# Altium schematic sheet Teensy Troller.SchDoc: Microcontroller with Sensors for Servos
size Letter; Author: Prof. Jeremy Daily; Organization: The University of Tulsa; Address1: Mechanical Engineering; Address2: 800 S. Tucker Dr; Address3: Tulsa, OK 74104; DocumentNumber: 1; Revision: 1; SheetNumber: 1; SheetTotal: 1
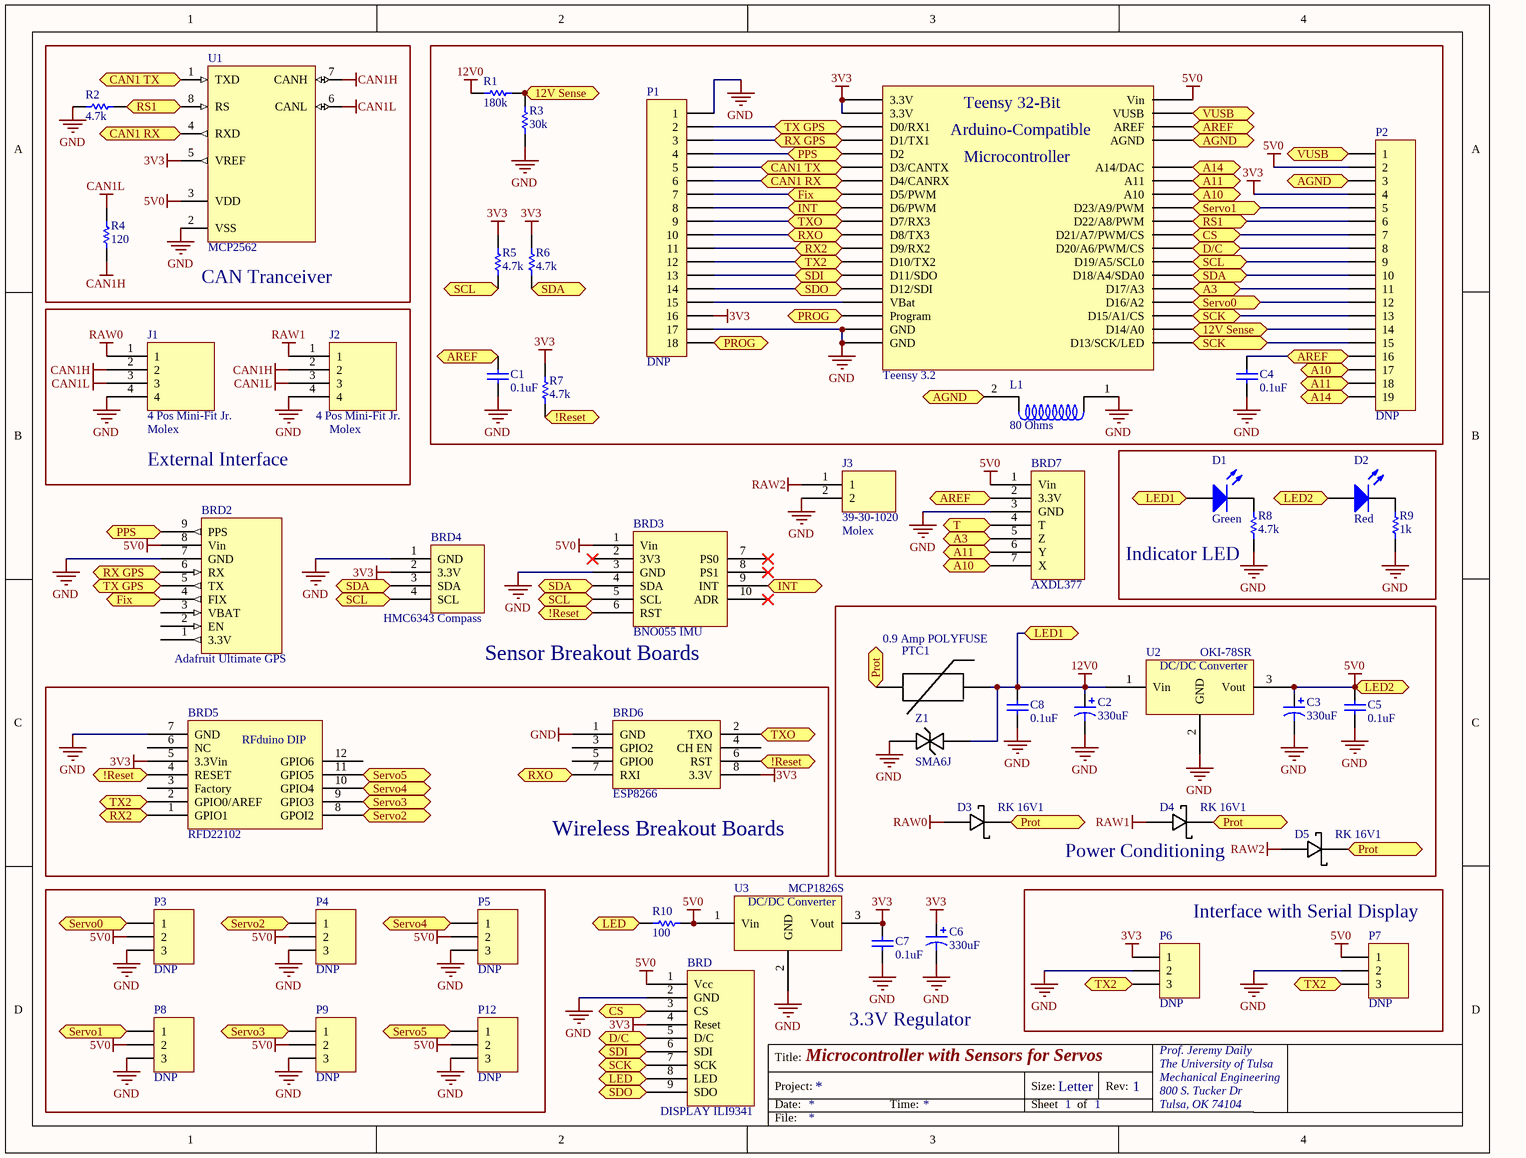
[diagram p0: Teensy Troller.SchDoc]

## Parts
BRD  DISPLAY ILI9341  [Display ILI9341]
BRD1  Teensy 3.2  [Teensy]
BRD2  Adafruit Ultimate GPS  [GPS]
BRD3  BNO055 IMU  [BNO055 Board]
BRD4  HMC6343 Compass  [HMC6343]
BRD5  RFD22102  [Simblee RFduino Adapter]
BRD6  ESP8266  [ESP8266]
BRD7  AXDL377  [AXDL377 Breakout]
C1  0.1uF  [RAD-0.2]
C2  330uF  [Elec. Cap 5 x 10mm]
C3  330uF  [Elec. Cap 5 x 10mm]
C4  0.1uF  [RAD-0.2]
C5  0.1uF  [RAD-0.2]
C6  330uF  [Elec. Cap 5 x 10mm]
C7  0.1uF  [RAD-0.2]
C8  0.1uF  [RAD-0.2]
D1  Green  [5mm Rad LED]
D2  Red  [5mm Rad LED]
D3  RK 16V1  [DIODE-0.4]
D4  RK 16V1  [DIODE-0.4]
D5  RK 16V1  [DIODE-0.4]
J1  4 Pos Mini-Fit Jr.  Manufacturer: Molex  [4 POS Vertical MINI-FIT JR]
J2  4 Pos Mini-Fit Jr.  Manufacturer: Molex  [4 POS Vertical MINI-FIT JR]
J3  39-30-1020  Manufacturer: Molex  [2 pos Mini-Fit Jr. R/A Header]
L1  80 Ohms  [0805]
P1  DNP  [HDR1X18]
P2  DNP  [HDR1X19]
P3  DNP  [HDR1X3]
P4  DNP  [HDR1X3]
P5  DNP  [HDR1X3]
P6  DNP  [HDR1X3]
P7  DNP  [HDR1X3]
P8  DNP  [HDR1X3]
P9  DNP  [HDR1X3]
P12  DNP  [HDR1X3]
PTC1  0.9 Amp POLYFUSE  [PTC]
R1  180k  [Axial-0.4]
R2  4.7k  [Axial-0.4]
R3  30k  [Axial-0.4]
R4  120  [Axial-0.4]
R5  4.7k  [Axial-0.4]
R6  4.7k  [Axial-0.4]
R7  4.7k  [Axial-0.4]
R8  4.7k  [Axial-0.4]
R9  1k  [Axial-0.4]
R10  100  [Axial-0.4]
U1  MCP2562  [PDIP300-P8]
U2  OKI-78SR  [78xx]
U3  MCP1826S  [78xx]
Z1  SMA6J  [DIODE-0.4]

## Blocks framed on the sheet
CAN Tranceiver: R2 R4 U1
External Interface: J1 J2
Indicator LED: D1 D2 R8 R9
Power Conditioning: C2 C3 C5 C8 D3-D5 PTC1 U2 Z1
Wireless Breakout Boards: BRD5 BRD6
Interface with Serial Display: P6 P7

## Ports
12V Sense, !Reset, A3, A10, A11, A14, AGND, AREF, CAN1 RX, CAN1 TX, CS, D/C, Fix, INT, LED, LED1, LED2, PPS, PROG, Prot, RS1, RX2, RX GPS, RXO, SCK, SCL, SDA, SDI, SDO, Servo0, Servo1, Servo2, Servo3, Servo4, Servo5, T, TX2, TX GPS, TXO, VUSB

## Nets
3V3: BRD.4(Reset) BRD1.16(3.3V) BRD1.31(3.3V) BRD4.2(3.3V) BRD5.5(3.3Vin) BRD6.8(3.3V) C6.1 C7.2 P1.16 P2.4 P6.1 R5.2 R6.2 R7.2 U1.5(VREF) U3.3(Vout)
5V0: BRD.1(Vcc) BRD1.33(Vin) BRD2.8(Vin) BRD3.1(Vin) BRD7.1(Vin) C3.1 C5.2 D2.1(A) P2.2 P3.2 P4.2 P5.2 P7.1 P8.2 P9.2 P12.2 R10.2 U1.3(VDD) U2.3(Vout) U3.1(Vin) ; port LED2
12V0: C2.1 C8.2 D1.1(A) PTC1.2 R1.1 U2.1(Vin) Z1.1(A) ; port LED1
CAN1H: J1.2 J2.2 R4.1 U1.7(CANH)
CAN1L: J1.3 J2.3 R4.2 U1.6(CANL)
GND: BRD.2(GND) BRD1.14(GND) BRD1.17(GND) BRD2.7(GND) BRD3.3(GND) BRD4.1(GND) BRD5.7(GND) BRD6.1(GND) BRD7.3(GND) C1.1 C2.2 C3.2 C4.1 C5.1 C6.2 C7.1 C8.1 J1.4 J2.4 J3.2 L1.1 P1.1 P1.17 P3.3 P4.3 P5.3 P6.2 P7.2 P8.3 P9.3 P12.3 R2.1 R3.1 R8.1 R9.1 U1.2(VSS) U2.2(GND) U3.2(GND) Z1.2(K)
RAW0: D3.1(A) J1.1
RAW1: D4.1(A) J2.1
RAW2: D5.1(A) J3.1
12V Sense: BRD1.21(D14/A0) P2.14 R1.2 R3.2 ; port 12V Sense
!Reset: BRD3.6(RST) BRD5.4(RESET) BRD6.6(RST) R7.1 ; port !Reset
A3: BRD1.24(D17/A3) BRD7.5(Z) P2.11 ; port A3
A10: BRD1.36(A10) BRD7.7(X) P2.17 ; port A10
A11: BRD1.37(A11) BRD7.6(Y) P2.18 ; port A11
A14: BRD1.19(A14/DAC) P2.19 ; port A14
AGND: BRD1.32(AGND) L1.2 P2.3 ; port AGND
AREF: BRD1.35(AREF) BRD7.2(3.3V) C1.2 C4.2 P2.16 ; port AREF
CAN1 RX: BRD1.9(D4/CANRX) P1.6 U1.4(RXD) ; port CAN1 RX
CAN1 TX: BRD1.10(D3/CANTX) P1.5 U1.1(TXD) ; port CAN1 TX
CS: BRD.3(CS) BRD1.28(D21/A7/PWM/CS) P2.7 ; port CS
D/C: BRD.5(D/C) BRD1.27(D20/A6/PWM/CS) P2.8 ; port D/C
Fix: BRD1.8(D5/PWM) BRD2.4(FIX) P1.7 ; port Fix
INT: BRD1.7(D6/PWM) BRD3.9(INT) P1.8 ; port INT
LED: BRD.8(LED) R10.1 ; port LED
PPS: BRD1.11(D2) BRD2.9(PPS) P1.4 ; port PPS
PROG: BRD1.18(Program) P1.18 ; port PROG
Prot: D3.2(K) D4.2(K) D5.2(K) PTC1.1 ; port Prot
RS1: BRD1.29(D22/A8/PWM) P2.6 R2.2 U1.8(RS) ; port RS1
RX2: BRD1.4(D9/RX2) BRD5.1(GPIO1) P1.11 ; port RX2
RX GPS: BRD1.12(D1/TX1) BRD2.6(RX) P1.3 ; port RX GPS
RXO: BRD1.5(D8/TX3) BRD6.7(RXI) P1.10 ; port RXO
SCK: BRD.7(SCK) BRD1.20(D13/SCK/LED) BRD1.22(D15/A1/CS) P2.13 P2.15 ; port SCK
SCL: BRD1.26(D19/A5/SCL0) BRD3.5(SCL) BRD4.4(SCL) P2.9 R5.1 ; port SCL
SDA: BRD1.25(D18/A4/SDA0) BRD3.4(SDA) BRD4.3(SDA) P2.10 R6.1 ; port SDA
SDI: BRD.6(SDI) BRD1.2(D11/SDO) P1.13 ; port SDI
SDO: BRD.9(SDO) BRD1.1(D12/SDI) P1.14 ; port SDO
Servo0: BRD1.23(D16/A2) P2.12 P3.1 ; port Servo0
Servo1: BRD1.30(D23/A9/PWM) P2.5 P8.1 ; port Servo1
Servo2: BRD5.8(GPOI2) P4.1 ; port Servo2
Servo3: BRD5.9(GPIO3) P9.1 ; port Servo3
Servo4: BRD5.10(GPIO4) P5.1 ; port Servo4
Servo5: BRD5.11(GPIO5) P12.1 ; port Servo5
T: BRD7.4(T) ; port T
TX2: BRD1.3(D10/TX2) BRD5.2(GPIO0/AREF) P1.12 P6.3 P7.3 ; port TX2
TX GPS: BRD1.13(D0/RX1) BRD2.5(TX) P1.2 ; port TX GPS
TXO: BRD1.6(D7/RX3) BRD6.2(TXO) P1.9 ; port TXO
VUSB: BRD1.34(VUSB) P2.1 ; port VUSB
NetBRD1_15: BRD1.15(VBat) P1.15
NetD1_2: D1.2(K) R8.2
NetD2_2: D2.2(K) R9.2

Not connected (* = marked no-connect by the designer): BRD2 1(3.3V) 2(EN) 3(VBAT); BRD3 2(3V3)* 7(PS0)* 8(PS1)* 10(ADR)*; BRD5 3(Factory) 6(NC) 12(GPIO6); BRD6 3(GPIO2) 4(CH_EN) 5(GPIO0)

## Notes on the sheet
- (near BRD3) Sensor Breakout Boards
- 3.3V Regulator
- Title:
- Project:
- Date:
- Time:
- Sheet
- Size:
- Letter
- of
- Rev:
- File:
- (in symbol 7805) DC/DC Converter
- (in symbol Simblee Adapter) RFduino DIP
- (in symbol Teensy) Teensy 32-Bit; Arduino-Compatible; Microcontroller

## Library data of the parts
BRD = Display: Color 320x240 Display, 2.2 inch, ILI9341 Controller https://www.pjrc.com/store/display_ili9341.html
BRD1 = Teensy: 32 Bit Arduino-Compatible Microcontroller; Manufacturer: PRJC; PartNumber: Teensy 3.2; Supplier 1: Sparkfun; Supplier Part Number 1: DEV-13736
BRD2 = GPS - Adafruit
BRD3 = BNO055 Board: Adafruit BNO055 Sensor Breakout Board
BRD4 = HMC6343: SparkFun HMC6343 Breakout  SEN-12916
BRD5 = Simblee Adapter: Bluetooth / 802.15.1 Development Tools RFduino BLE 4.0 DIP (Arduino-Compatible); Manufacturer: RF Digital Wireless; PartNumber: RFD22102; Supplier 1: Mouser; Supplier Part Number 1: 975-RFD22102
BRD6 = ESP8266: Sparkfun ESP8266 Module (WRL-13678)
BRD7 = AXDL377 Breakout: Adafruit ADXL377 - High-G Triple-Axis Accelerometer (+-200g Analog Out)
C1 C4 C5 C7 C8 = Cap: CAP CER 0.1UF 50V 10% X7R 0603; Manufacturer: Murata Electronics North America; PartNumber: GRM188R71H104KA93D; Supplier 1: Digi-Key; Supplier Part Number 1: 490-1519-1-ND
C2 C3 C6 = SMD Elec: CAP ALUM 330UF 20% 50V RADIAL; Manufacturer: Panasonic Electronic Components; PartNumber: ECA-1HM331; Supplier 1: Digi-Key; Supplier Part Number 1: P5184-ND
D1 = LED - Green: LED GREEN DIFFUSED 0805 SMD; Manufacturer: OSRAM Opto Semiconductors Inc.; PartNumber: LG R971-KN-1; Supplier 1: Digi-Key; Supplier Part Number 1: 475-1410-1-ND
D2 = LED - SMD: LED RED DIFFUSED 0805 SMD; Manufacturer: OSRAM Opto Semiconductors Inc.; PartNumber: LS R976-NR-1; Supplier 1: Digi-Key; Supplier Part Number 1: 475-1278-1-ND
D3-D5 = Schottky Diode: DIODE SCHOTTKY 60V 2A AXIAL; Manufacturer: Sanken; Supplier 1: Digi-Key; Supplier Part Number 1: RK 16V1CT-ND; PartNumber: RK 16V1
J1 J2 = 4 Pos Header Vert: CONN HEADER 4POS 4.2MM VERT TIN; Supplier 1: Digi-Key; Supplier 2: Mouser; PartNumber: 39-29-9040; Supplier Part Number 2: 538-39-29-9040
J3 = 2 Pos Header: PartNumber: 39-30-1020; Supplier 1: Mouser; Supplier 2: Digi-Key; Supplier Part Number 1: 538-39-30-1020; Supplier Part Number 2: WM1351-ND
L1 = Ferrite Bead: Ferrite Bead 80ohms 100MHz 5A Monolithic 0805 SMD; Manufacturer: Laird Technologies; PartNumber: HI0805R800R-10; Supplier 1: Mouser; Supplier Part Number 1: 875-HI0805R800R-10
P1 = Header 18: Header, 18-Pin; LatestRevisionDate: 17-Jul-2002; LatestRevisionNote: Re-released for DXP Platform.; Publisher: Altium Limited
P2 = Header 19: Header, 19-Pin; LatestRevisionDate: 17-Jul-2002; LatestRevisionNote: Re-released for DXP Platform.; Publisher: Altium Limited
P3-P9 P12 = Header 3: Header, 3-Pin; LatestRevisionDate: 17-Jul-2002; LatestRevisionNote: Re-released for DXP Platform.; Publisher: Altium Limited
PTC1 = PTC: Resettable Fuses - PPTC 60V POLYFUSE .900A RADIAL LEADS; Manufacturer: Littelfuse; PartNumber: 60R090XU; Supplier 1: Mouser; Supplier Part Number 1: 507-1768-1-ND
R1 R3 R4 R8-R10 = Chip Resistor: RES SMD 1K OHM 1% 1/10W 0603; Manufacturer: Panasonic Electronic Components; PartNumber: ERJ-3EKF1001V; Supplier 1: Digi-Key; Supplier Part Number 1: P1.00KHCT-ND
R2 R5-R7 = Chip Resistor: RES SMD 4.7K OHM 1% 1/8W 0805; Manufacturer: Panasonic Electronic Components; PartNumber: ERJ-6ENF4701V; Supplier 1: Digi-Key; Supplier Part Number 1: P4.70KCCT-ND
U1 = MCP2551-I/P: High-Speed CAN Transceiver, 8-Pin PDIP, Industrial Temperature; Manufacturer: Microchip; PartNumber: MCP2562FD-E/P; DatasheetVersion: revF, Jul-2010; PackageVersion: revBB, Aug-2009; PackageReference: PDIP300-P8; PackageDescription: 8-Lead Plastic Dual In-Line (P) - 300 mil Body [PDIP]; Supplier 1: Mouser; Supplier Part Number 1: 579-MCP2562FD-E/P; Supplier 2: Farnell; Supplier Part Number 2: 1292240; Supplier 3: Newark; Supplier Part Number 3: 61K2947; Supplier 4: Mouser; Supplier Part Number 4: 579-MCP2551-I/P; Mounting Technology: Through Hole; Code_JEDEC: MS-001; ComponentLink1Description: Manufacturer URL; ComponentLink1URL: http://www.microchip.com/; ComponentLink2Description: Datasheet; ComponentLink2URL: http://ww1.microchip.com/downloads/en/DeviceDoc/21667F.pdf; ComponentLink3Description: Package Specification; ComponentLink3URL: http://www.microchip.com/stellent/groups/techpub_sg/documents/packagingspec/en012702.pdf
U2 = 7805: 5V DC/DC Converter (7805 replacement); Manufacturer: Murata Power Solutions; PartNumber: OKI-78SR-5/1.5-W36H-C; Supplier 1: Mouser; Supplier 2: Digi-Key; Supplier Part Number 1: 580-OKI78SR51.5W36HC; Supplier Part Number 2: 811-2692-ND
U3 = 7805: LDO Voltage Regulators 1A CMOS LDO Vout 3.3V ETR; Manufacturer: Microchip; Supplier 1: Mouser; Supplier 2: Digi-Key; Supplier Part Number 1: 579-MCP1826S-3302EAB; Supplier Part Number 2: 811-2692-ND; PartNumber: MCP1826S
Z1 = Zener - Bidirectional: TVS DIODE 15VWM 24.4VC SMA; Manufacturer: STMicroelectronics; PartNumber: P6KE18CA; Supplier 1: Mouser; Supplier Part Number 1: 511-P6KE18CA